# EAGLE design CRD (EAGLE 9.5.2)
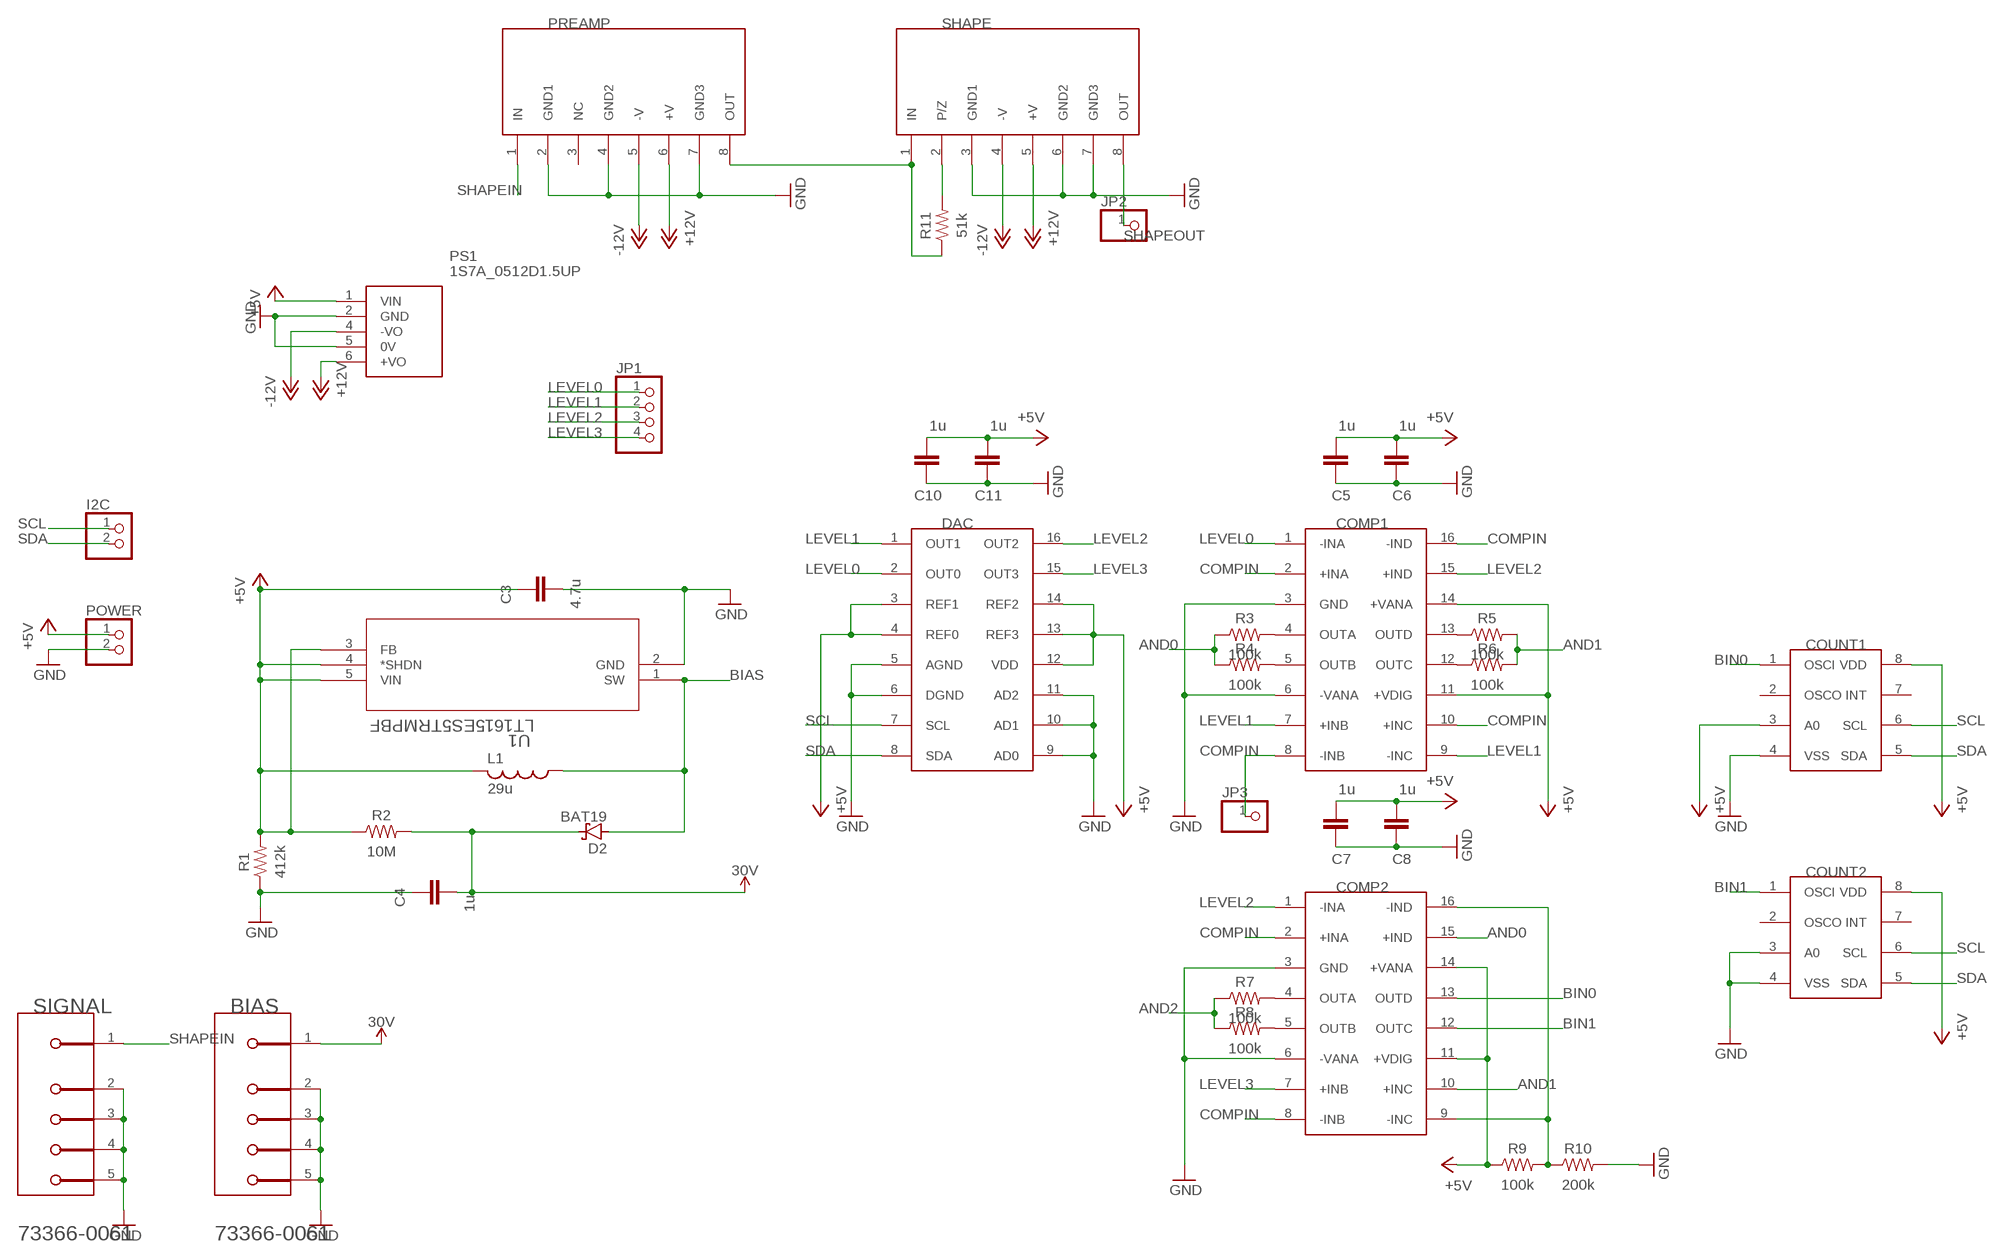
[diagram p0: schematic, sheet 1]

## Parts
BIAS  MOLEX_73366-0061MOLEX_73366-0061_0_0  [MOLEX_73366-0061_0]
C3  4.7u  GRM31CR60J107ME39L  [CAP_1206]
C4  1u  GRM31CR60J107ME39L  [CAP_1206]
C5  1u  GRM31CR60J107ME39L  [CAP_1206]
C6  1u  GRM31CR60J107ME39L  [CAP_1206]
C7  1u  GRM31CR60J107ME39L  [CAP_1206]
C8  1u  GRM31CR60J107ME39L  [CAP_1206]
C10  1u  GRM31CR60J107ME39L  [CAP_1206]
C11  1u  GRM31CR60J107ME39L  [CAP_1206]
COMP1  AD8564ARZ  [SOIC127P1032X265-16N]
COMP2  AD8564ARZ  [SOIC127P1032X265-16N]
COUNT1  PCF8583  [SOIC127P1032X265-8N]
COUNT2  PCF8583  [SOIC127P1032X265-8N]
D2  BAT19  [DO35-10]
DAC  MAX520BEWE+  [SOIC127P1032X265-16N]
I2C  PINHD-1X2  [1X02]
JP1  PINHD-1X4  [1X04]
JP2  PINHD-1X1  [1X01]
JP3  PINHD-1X1  [1X01]
L1  29u  L-USL1812  [L1812]
POWER  PINHD-1X2  [1X02]
PREAMP  CR-113  [HDRV8W64P254_1X8_1016X508X838B]
PS1  1S7A_0512D1.5UP  [1S7A_0505D15UP]
R1  412k  R-US_AXIAL-11.7MM-PITCH  [RESAD1176W63L850D250B]
R2  10M  R-US_AXIAL-11.7MM-PITCH  [RESAD1176W63L850D250B]
R3  100k  R-US_AXIAL-11.7MM-PITCH  [RESAD1176W63L850D250B]
R4  100k  R-US_AXIAL-11.7MM-PITCH  [RESAD1176W63L850D250B]
R5  100k  R-US_AXIAL-11.7MM-PITCH  [RESAD1176W63L850D250B]
R6  100k  R-US_AXIAL-11.7MM-PITCH  [RESAD1176W63L850D250B]
R7  100k  R-US_AXIAL-11.7MM-PITCH  [RESAD1176W63L850D250B]
R8  100k  R-US_AXIAL-11.7MM-PITCH  [RESAD1176W63L850D250B]
R9  100k  R-US_AXIAL-11.7MM-PITCH  [RESAD1176W63L850D250B]
R10  200k  R-US_AXIAL-11.7MM-PITCH  [RESAD1176W63L850D250B]
R11  51k  R-US_AXIAL-11.7MM-PITCH  [RESAD1176W63L850D250B]
SHAPE  CR-200  [HDRV8W64P254_1X8_1016X508X838B]
SIGNAL  MOLEX_73366-0061MOLEX_73366-0061_0_0  [MOLEX_73366-0061_0]
U1  LT1615ES5TRMPBF  [SOT-5_S]

## Nets
+5V: C3.1 C5.2 C6.2 C7.2 C8.2 C10.2 C11.2 COMP1.11(+VDIG) COMP1.14(+VANA) COMP2.11(+VDIG) COMP2.14(+VANA) COUNT1.3(A0) COUNT1.8(VDD) COUNT2.8(VDD) DAC.3(REF1) DAC.4(REF0) DAC.12(VDD) DAC.13(REF3) DAC.14(REF2) L1.2 POWER.1 PS1.1(VIN) R1.2 R2.1 R9.1 U1.3(FB) U1.4(*SHDN) U1.5(VIN)
+12V: PREAMP.6(+V) PS1.6(+VO) SHAPE.5(+V)
-12V: PREAMP.5(-V) PS1.4(-VO) SHAPE.4(-V)
AND0: COMP2.15(+IND) R3.1 R4.1
AND1: COMP2.10(+INC) R5.2 R6.2
AND2: R7.1 R8.1
BIAS: D2.A L1.1 U1.1(SW)
BIN0: COMP2.13(OUTD) COUNT1.1(OSCI)
BIN1: COMP2.12(OUTC) COUNT2.1(OSCI)
COMPIN: COMP1.2(+INA) COMP1.8(-INB) COMP1.10(+INC) COMP1.16(-IND) COMP2.2(+INA) COMP2.8(-INB) JP3.1
GND: BIAS.2(MNT_1) BIAS.3(MNT_2) BIAS.4(MNT_3) BIAS.5(MNT_4) C3.2 C4.1 C5.1 C6.1 C7.1 C8.1 C10.1 C11.1 COMP1.3(GND) COMP1.6(-VANA) COMP2.3(GND) COMP2.6(-VANA) COUNT1.4(VSS) COUNT2.3(A0) COUNT2.4(VSS) DAC.5(AGND) DAC.6(DGND) DAC.9(AD0) DAC.10(AD1) DAC.11(AD2) POWER.2 PREAMP.2(GND1) PREAMP.4(GND2) PREAMP.7(GND3) PS1.2(GND) PS1.5(0V) R1.1 R10.2 SHAPE.3(GND1) SHAPE.6(GND2) SHAPE.7(GND3) SIGNAL.2(MNT_1) SIGNAL.3(MNT_2) SIGNAL.4(MNT_3) SIGNAL.5(MNT_4) U1.2(GND)
LEVEL0: COMP1.1(-INA) DAC.2(OUT0) JP1.1
LEVEL1: COMP1.7(+INB) COMP1.9(-INC) DAC.1(OUT1) JP1.2
LEVEL2: COMP1.15(+IND) COMP2.1(-INA) DAC.16(OUT2) JP1.3
LEVEL3: COMP2.7(+INB) DAC.15(OUT3) JP1.4
N$3: COMP1.4(OUTA) R3.2
N$4: COMP1.5(OUTB) R4.2
N$5: COMP1.13(OUTD) R5.1
N$6: COMP1.12(OUTC) R6.1
N$7: COMP2.4(OUTA) R7.2
N$8: COMP2.5(OUTB) R8.2
N$9: PREAMP.8(OUT) R11.1 SHAPE.1(IN)
N$10: R11.2 SHAPE.2(P/Z)
N$12: COMP2.9(-INC) COMP2.16(-IND) R9.2 R10.1
SCL: COUNT1.6(SCL) COUNT2.6(SCL) DAC.7(SCL) I2C.1
SDA: COUNT1.5(SDA) COUNT2.5(SDA) DAC.8(SDA) I2C.2
SHAPEIN: PREAMP.1(IN) SIGNAL.1
SHAPEOUT: JP2.1 SHAPE.8(OUT)
VIN: BIAS.1 C4.2 D2.C R2.2 ; supply symbol labelled 30V
Unconnected: COUNT1.2(OSCO) COUNT1.7(INT) COUNT2.2(OSCO) COUNT2.7(INT) PREAMP.3(NC)

## Library data of the parts
BIAS SIGNAL = Molex - 73366-0061:MOLEX_73366-0061: MCX Connector Jack, Female Socket 50Ohm Through Hole Solder; AUTOMOTIVE: No; CENTROID_NOT_SPECIFIED: No; CONN_ORIENTATION: Straight; CONTACT_MATERIAL: Gold,Nickel; DATASHEET: https://www.molex.com/webdocs/datasheets/pdf/en-us/0733660061_RF_COAX_CONNECTORS.pdf; DEVICE_CLASS_L1: Connectors; DEVICE_CLASS_L2: RF / Coaxial Connectors; DEVICE_CLASS_L3: unset; DIELECTRIC_MATERIAL: PTFE; DIGIKEY_DESCRIPTION: CONN MCX JACK STR 50 OHM PCB; DIGIKEY_PART_NUMBER: WM5541-ND; FOOTPRINT_URL: https://www.molex.com/pdm_docs/sd/733660061_sd.pdf; FOOTPRINT_VARIANT_NAME_0: Recommended_Land_Pattern; FREQUENCY: 6GHz; HEIGHT: 5.23mm; IMPEDANCE: 50Ω; IS_FEMALE: yes; LEAD_FREE: Yes; MF: Molex; MFG_PACKAGE_IDENT: 0; MFG_PACKAGE_IDENT_DATE: 0; MFG_PACKAGE_IDENT_REV: 0; MOUSER_DESCRIPTION: RF Connectors / Coaxial Connectors MCX PCB JACK; MOUSER_PART_NUMBER: 538-73366-0061; MPN: 73366-0061; NUMBER_OF_CONTACTS: 1; PACKAGE: CONN_JACK; PREFIX: J; ROHS: Yes; SHIELDING: true; STANDOFF_HEIGHT: 0.05mm; TEMPERATURE_RANGE_HIGH: +155°C; TEMPERATURE_RANGE_LOW: -55°C; VERIFICATION_VERSION: 0.0.0.3; VOLTAGE_RATING: 335V
C3-C8 C10 C11 = Resistor_Capacitor:GRM31CR60J107ME39L: CAP CER 100UF 6.3V X5R 1206 Manufacturer's datasheet <https://www.murata.com/~/media/webrenewal/support/library/catalog/products/capacitor/mlcc/c02e.ashx?la=en-us>; CREATED_BY: PCBLayout.com; DIGIKEY_PART_NUMBER: GRM31CR60J107ME39L; MANUFACTURER: Murata Electronics North America; MPN: GRM31CR60J107ME39L; PACKAGE: SMD 1206
COMP1 COMP2 = CRD:AD8564ARZ
COUNT1 COUNT2 = CRD:PCF8583
D2 = diode:BAT19: DIODE barrier diode
DAC = CRD:MAX520BEWE+
I2C POWER = pinhead:PINHD-1X2: PIN HEADER
JP1 = pinhead:PINHD-1X4: PIN HEADER
JP2 JP3 = pinhead:PINHD-1X1: PIN HEADER
L1 = rcl:L-US: INDUCTOR, American symbol; SPICEPREFIX: L
PREAMP = CRD:CR-113
PS1 = 1S7A_0512D1.5UP:1S7A_0512D1.5UP: 1W ? Dual Output DC-DC Converter - Fixed Input - Isolated & Unregulated Source: Datasheet <https://gaptec-electronic.com/datenblaetter/1S7A_1.5UP.pdf>; DESCRIPTION: 1W ? Dual Output DC-DC Converter - Fixed Input - Isolated & Unregulated; HEIGHT: 10.41mm; MANUFACTURER_NAME: Gaptec; MANUFACTURER_PART_NUMBER: 1S7A_0512D1.5UP
R1-R11 = Resistor:R-US: Resistor Fixed - ANSI; CATEGORY: Resistor; SUB-CATEGORY: Fixed
SHAPE = CRD:CR-200
U1 = LT1615ES5TRMPBF:LT1615ES5TRMPBF; DESCRIPTION: Conv DC-DC 1.2V to 15V Step Up Single-Out 1.23V to 36V 0.4A Micropower 5-Pin TSOT-23 T/R; DIGI-KEY_PART_NUMBER: LT1615ES5#TRMPBFCT-ND; MF: Analog Devices; MP: LT1615ES5#TRMPBF; PACKAGE: SOT-5 Analog Devices; PURCHASE-URL: https://pricing.snapeda.com/search/part/LT1615ES5#TRMPBF/?ref=eda

## Board
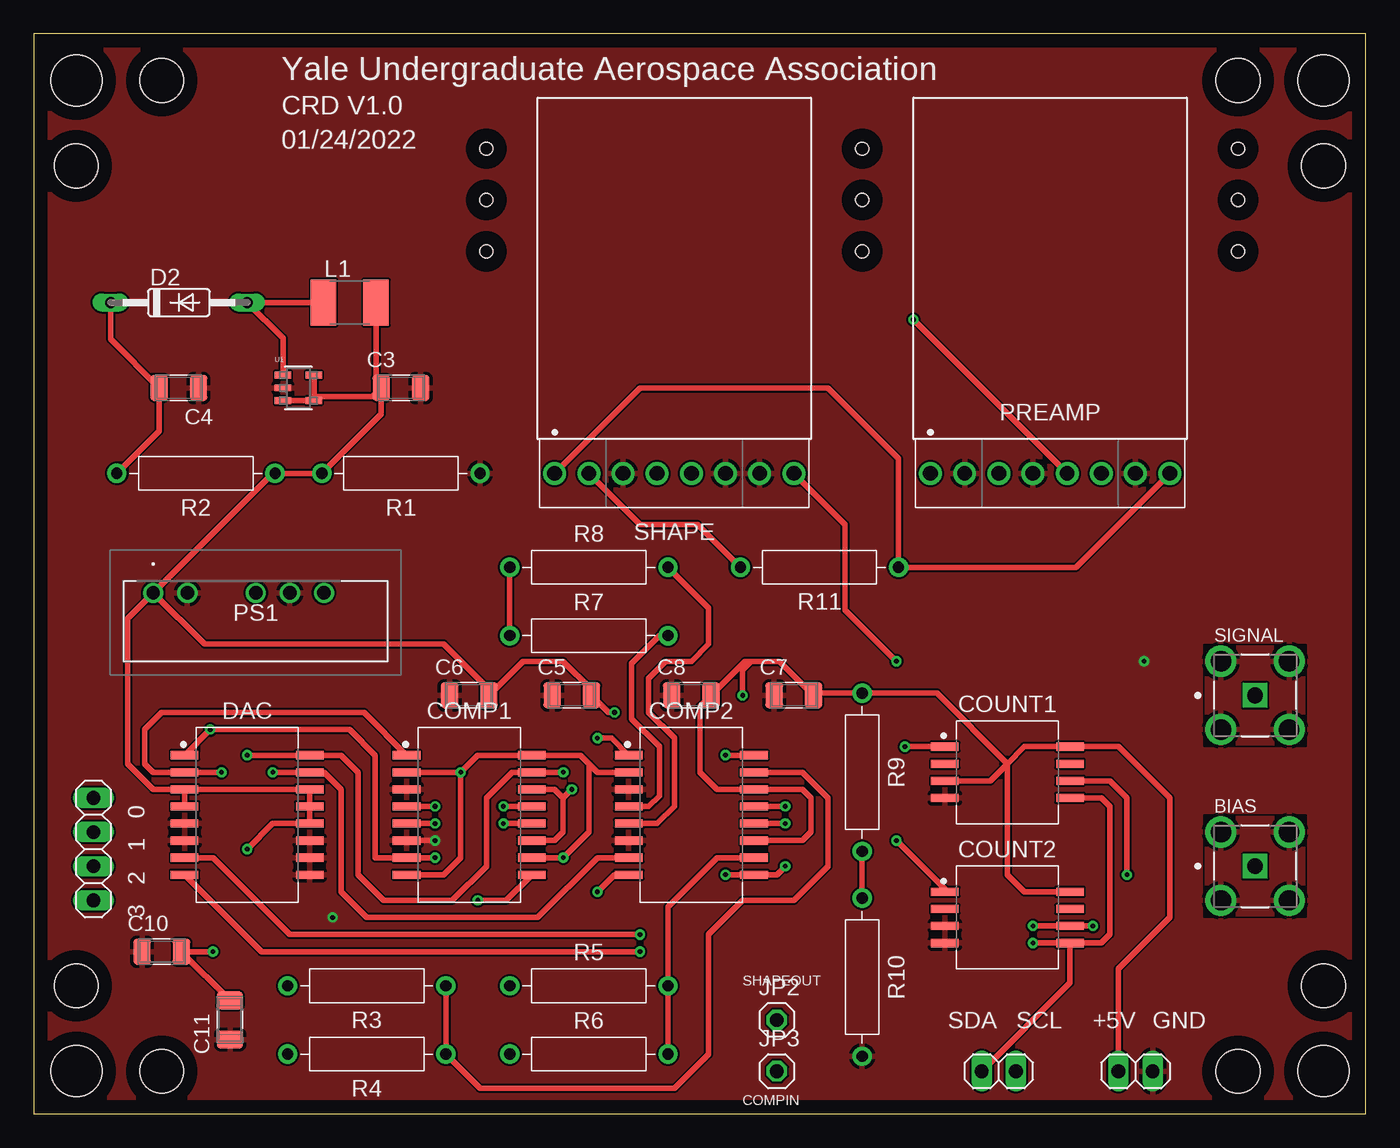
[diagram p1: board, top side]
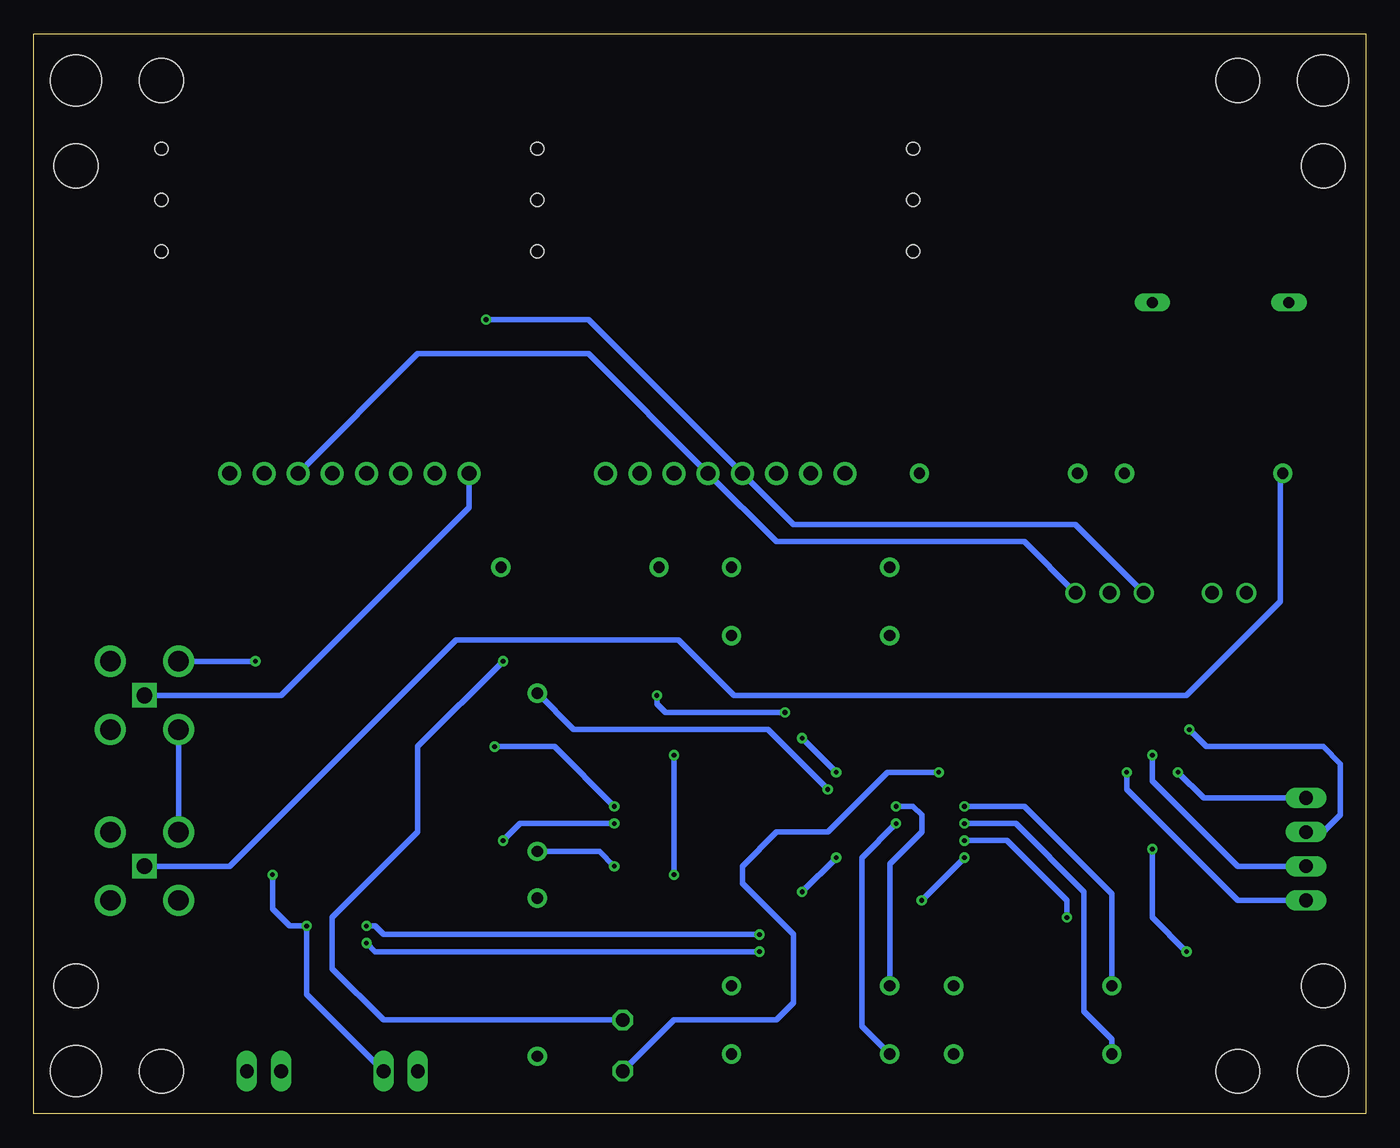
[diagram p2: board, bottom side, seen from below]

Size 99.04 x 80.31 mm. Coordinates in mm from the lower left corner, seen from the top.
Outline: 0,0 99.04,0 99.04,80.31 0,80.31 0,0
Copper layers (1*16): Top 0.035mm / dielectric 1.5mm / Bottom 0.035mm
Design rules "default": minimum track width 6mil, minimum drill 0.35mm, track to track 6mil, track to pad 6mil, pad to pad 6mil, via to via 6mil, smd to smd 6mil, copper to edge 40mil, drill to drill 6mil, minimum pad ring 10mil, minimum via ring 8mil, stop-mask expansion 4mil, vias tented up to drill 0mil, thermal gap 10mil
Holes 0.97 mm at 33.66,67.95 33.66,71.75 61.59,71.75 61.59,67.95 89.53,64.14 89.53,71.75 89.53,67.95 33.66,64.14 61.59,64.14
Holes 3.8 mm at 3.18,76.84 95.89,76.84 3.18,3.18 95.89,3.18
Holes 3.26 mm at 3.18,70.48 9.53,76.84 3.18,9.53 9.53,3.18 95.89,9.53 89.53,3.18 89.53,76.84 95.89,70.48

### Footprints (pad centres in the part's own frame; a part is rotated, then mirrored left to right if it is on the bottom)
MOLEX_73366-0061_0 = drill 1.17 pad 1.82 square: 1 0,0 | drill 1.52 pad 2.32: 2 -2.54,2.54; 3 2.54,2.54; 4 -2.54,-2.54; 5 2.54,-2.54
CAP_1206 = smd 1.29 x 1.91: 1 -1.46,0; 2 1.46,0
SOIC127P1032X265-16N = smd 2.052 x 0.602: 1 -4.654,4.445; 2 -4.654,3.175; 3 -4.654,1.905; 4 -4.654,0.635; 5 -4.654,-0.635; 6 -4.654,-1.905; 7 -4.654,-3.175; 8 -4.654,-4.445; 9 4.654,-4.445; 10 4.654,-3.175; 11 4.654,-1.905; 12 4.654,-0.635; 13 4.654,0.635; 14 4.654,1.905; 15 4.654,3.175; 16 4.654,4.445
SOIC127P1032X265-8N = smd 2.052 x 0.602: 1 -4.654,1.905; 2 -4.654,0.635; 3 -4.654,-0.635; 4 -4.654,-1.905; 5 4.654,-1.905; 6 4.654,-0.635; 7 4.654,0.635; 8 4.654,1.905
DO35-10 = drill 0.813 long: A 5.08,0; C -5.08,0
1X02 = drill 1.016 long: 1 -1.27,0; 2 1.27,0
1X04 = drill 1.016 long: 1 -3.81,0; 2 -1.27,0; 3 1.27,0; 4 3.81,0
1X01 = drill 1.016 octagon: 1 0,0
L1812 = smd 1.9 x 3.4: 1 -1.95,0; 2 1.95,0
HDRV8W64P254_1X8_1016X508X838B = drill 1.105 pad 1.705: 1 0,0; 2 2.54,0; 3 5.08,0; 4 7.62,0; 5 10.16,0; 6 12.7,0; 7 15.24,0; 8 17.78,0
1S7A_0505D15UP = drill 1 pad 1.5: 1 0,0; 2 2.54,0; 4 7.62,0; 5 10.16,0; 6 12.7,0
RESAD1176W63L850D250B = drill 0.83 pad 1.43: 1 -5.88,0; 2 5.88,0
SOT-5_S = smd 1.211 x 0.501: 1 -1.15,0.95; 2 -1.15,0; 3 -1.15,-0.95; 4 1.15,-0.95; 5 1.15,0.95

### Placement (x,y rotation side)
BIAS  90.8,18.41 0 top
C3  27.3,53.98 0 top
C4  10.79,53.98 180 top
C5  40,31.12 0 top
C6  32.38,31.12 0 top
C7  56.52,31.12 0 top
C8  48.89,31.12 0 top
C10  9.53,12.06 0 top
C11  14.6,6.99 90 top
COMP1  32.38,22.23 0 top
COMP2  48.89,22.23 0 top
COUNT1  72.39,25.4 0 top
COUNT2  72.39,14.61 0 top
D2  10.79,60.33 0 top
DAC  15.88,22.23 0 top
I2C  71.75,3.18 180 top
JP1  4.45,19.69 270 top
JP2  55.25,6.99 0 top
JP3  55.25,3.18 0 top
L1  23.49,60.33 0 top
POWER  81.91,3.18 0 top
PREAMP  66.67,47.62 0 top
PS1  8.89,38.73 0 top
R1  27.3,47.62 180 top
R2  12.06,47.62 180 top
R3  24.77,9.53 180 top
R4  24.77,4.45 180 top
R5  41.27,9.53 0 top
R6  41.27,4.45 0 top
R7  41.27,35.56 0 top
R8  41.27,40.64 0 top
R9  61.59,25.4 270 top
R10  61.59,10.16 270 top
R11  58.42,40.64 180 top
SHAPE  38.73,47.62 0 top
SIGNAL  90.8,31.12 0 top
U1  19.69,53.98 0 top

### Tracks (layer width: path | path; a pad name or v marks a point on that pad's centre or on a via)
+5V  (via drill 0.35)
  Top 0.406: C3.1 25.21,53.34 21.15,53.34 U1.4 | C3.1 25.84,52.05 R1.2 R2.1 17.78,47.62 PS1.1 | DAC.4 DAC.3 | COMP1.14 38.73,24.13 39.37,23.5 | 39.37,23.5 39.37,20.96 38.73,20.32 COMP1.11 | 72.39,26.04 71.12,24.77 COUNT1.3 | 72.39,26.04 73.66,27.3 COUNT1.8 80.64,27.3 84.45,23.5 84.45,14.61 80.64,10.79 POWER.1 | COUNT2.8 73.66,16.51 72.39,17.78 72.39,26.04 | L1.2 25.45,54.38 C3.1 | DAC.3 DAC.14 DAC.13 DAC.12 17.78,21.59 v15.88,19.69 | 53.34,33.66 52.89,33.66 C8.2 49.53,30.29 49.53,25.4 50.8,24.13 COMP2.14 57.15,24.13 57.78,23.5 57.78,20.96 57.15,20.32 COMP2.11 | 53.34,33.66 55.44,33.66 C7.2 58.14,31.28 R9.1 67.14,31.28 72.39,26.04 | DAC.3 8.89,24.13 6.99,26.04 6.99,36.83 PS1.1 | 39.37,23.5 v40,24.13 | v43.18,29.84 42.73,29.84 C5.2 41.46,31.56 39.37,33.66 36.38,33.66 C6.2 33.84,31.56 30.48,34.93 12.7,34.93 PS1.1 | v52.7,31.12 52.7,33.02 53.34,33.66 | U1.3 U1.4 | U1.4 U1.5 | v13.33,12.06 C10.2 C11.2
  Bottom 0.406: v40,24.13 44.45,28.58 58.89,28.58 R9.1 | v43.18,29.84 52.07,29.84 52.7,30.48 v52.7,31.12 | v13.33,12.06 15.88,14.61 v15.88,19.69
+12V
  Bottom 0.406: PS1.6 25.4,42.55 43.81,42.55 SHAPE.5 57.78,56.52 70.48,56.52 PREAMP.6
-12V  (via drill 0.35)
  Top 0.406: v65.41,59.06 PREAMP.5
  Bottom 0.406: PS1.4 21.59,43.82 42.55,43.82 SHAPE.4 57.78,59.06 v65.41,59.06
AND0
  Top 0.406: R3.1 R4.1 33.18,1.91 47.62,1.91 50.16,4.45 50.16,13.33 52.7,15.88 56.52,15.88 59.05,18.41 59.05,23.5 57.15,25.4 COMP2.15
AND1
  Top 0.406: COMP2.10 50.8,19.05 47.16,15.4 R5.2 R6.2
AND2
  Top 0.406: R8.1 R7.1
BIAS
  Top 0.406: U1.1 18.53,57.67 D2.A L1.1
BIN0  (via drill 0.35)
  Top 0.406: COMP2.13 v55.88,22.86 | v64.77,27.3 COUNT1.1
  Bottom 0.406: v55.88,22.86 60.33,27.3 v64.77,27.3
BIN1  (via drill 0.35)
  Top 0.406: COMP2.12 v55.88,21.59 | v64.14,20.32 67.74,16.72 COUNT2.1
  Bottom 0.406: v55.88,21.59 62.86,21.59 v64.14,20.32
COMPIN  (via drill 0.35)
  Top 0.406: COMP1.2 v31.75,25.4 | v31.75,25.4 33.02,26.67 COMP1.16 40.64,26.67 41.27,26.04 | COMP1.8 30.48,17.78 31.75,19.05 v31.75,25.4 | COMP1.10 v39.37,19.05 41.27,20.96 41.27,26.04 | COMP2.2 41.91,25.4 41.27,26.04 | COMP2.8 43.18,17.78 v41.91,16.51
  Bottom 0.406: v41.91,16.51 v39.37,19.05 | v31.75,25.4 35.56,25.4 40,20.96 43.81,20.96 46.35,18.41 46.35,17.15 42.55,13.33 42.55,8.26 43.81,6.99 51.43,6.99 JP3.1
GND  (via drill 0.35)
  Top 0.406: COMP1.6 v29.84,20.32
  Bottom 0.406: SIGNAL.4 BIAS.2 | v29.84,20.32 26.67,20.32 22.23,15.88 v22.23,14.61 | SIGNAL.2 v82.55,33.66
  pour Top: 0,0 0,80.01 99.06,80.01 99.06,0
LEVEL0  (via drill 0.35)
  Top 0.406: COMP1.1 24.56,29.84 9.53,29.84 8.26,28.58 8.26,26.04 8.89,25.4 DAC.2 v13.97,25.4
  Bottom 0.406: v13.97,25.4 12.06,23.5 JP1.1
LEVEL1  (via drill 0.35)
  Top 0.406: DAC.1 v13.13,28.58 23.49,28.58 25.4,26.67 25.4,19.05 COMP1.7 v29.84,19.05 | COMP1.9 35.13,15.88 v33.02,15.88
  Bottom 0.406: v29.84,19.05 v33.02,15.88 | v13.13,28.58 11.86,27.3 3.18,27.3 1.9,26.04 1.9,22.23 3.18,20.96 JP1.2
LEVEL2  (via drill 0.35)
  Top 0.406: v39.37,25.4 COMP1.15 35.56,25.4 33.66,23.5 33.66,18.41 31.11,15.88 26.03,15.88 24.13,17.78 24.13,25.4 22.86,26.67 DAC.16 v15.88,26.67 | v41.91,27.94 42.97,27.94 COMP2.1
  Bottom 0.406: v39.37,25.4 v41.91,27.94 | v15.88,26.67 15.88,24.77 9.53,18.41 JP1.3
LEVEL3  (via drill 0.35)
  Top 0.406: COMP2.7 41.91,19.05 37.46,14.61 24.77,14.61 22.86,16.51 22.86,24.13 21.59,25.4 DAC.15 v17.78,25.4
  Bottom 0.406: v17.78,25.4 17.78,24.13 9.53,15.88 JP1.4
N$3  (via drill 0.35)
  Top 0.406: COMP1.4 v29.84,22.86
  Bottom 0.406: v29.84,22.86 25.4,22.86 18.88,16.34 R3.2
N$4  (via drill 0.35)
  Top 0.406: COMP1.5 v29.84,21.59
  Bottom 0.406: v29.84,21.59 26.03,21.59 20.95,16.51 20.95,7.62 18.88,5.55 R4.2
N$5  (via drill 0.35)
  Top 0.406: COMP1.13 v34.92,22.86
  Bottom 0.406: v34.92,22.86 33.66,22.86 33.02,22.23 33.02,20.96 35.39,18.58 R5.1
N$6  (via drill 0.35)
  Top 0.406: COMP1.12 v34.92,21.59
  Bottom 0.406: v34.92,21.59 37.46,19.05 37.46,6.51 R6.1
N$7
  Top 0.406: COMP2.4 45.72,22.86 46.52,23.66 46.52,27.3 44.45,29.38 44.45,33.49 46.52,35.56 R7.2
N$8
  Top 0.406: COMP2.5 46.35,21.59 47.62,22.86 47.62,27.94 45.72,29.84 45.72,32.39 46.99,33.66 48.89,33.66 50.16,34.93 50.16,37.63 R8.2
N$9
  Top 0.406: SHAPE.1 45.09,53.98 59.05,53.98 64.3,48.73 R11.1 77.47,40.64 PREAMP.8
N$10
  Top 0.406: SHAPE.2 45.09,43.82 47.62,43.82 48.26,43.82 49.36,43.82 R11.2
N$12  (via drill 0.35)
  Top 0.406: v51.43,17.78 COMP2.9 55.25,17.78 v55.88,18.41 | v51.43,26.67 COMP2.16 | R9.2 R10.1
  Bottom 0.406: v51.43,17.78 v51.43,26.67 | v55.88,18.41 56.98,19.52 R9.2
SCL  (via drill 0.35)
  Top 0.406: COUNT1.6 80.01,24.77 81.28,23.5 v81.28,17.78 | v78.74,13.97 COUNT2.6 v74.3,13.97 | DAC.7 13.33,19.05 19.05,13.33 v45.09,13.33
  Bottom 0.406: v81.28,17.78 81.28,15.24 80.01,13.97 v78.74,13.97 78.74,8.89 I2C.1 | v45.09,13.33 73.02,13.33 73.66,13.97 v74.3,13.97
SDA  (via drill 0.35)
  Top 0.406: COUNT1.5 79.38,23.5 80.01,22.86 80.01,13.33 79.38,12.7 COUNT2.5 | COUNT2.5 77.04,9.73 I2C.2 | DAC.8 16.94,12.06 v45.09,12.06 | v74.3,12.7 COUNT2.5
  Bottom 0.406: v45.09,12.06 73.66,12.06 v74.3,12.7
SHAPEIN
  Bottom 0.406: SIGNAL.1 80.64,31.12 66.67,45.09 PREAMP.1
SHAPEOUT  (via drill 0.35)
  Top 0.406: SHAPE.8 60.33,43.82 60.33,37.47 v64.14,33.66
  Bottom 0.406: v64.14,33.66 70.48,27.3 70.48,20.96 76.83,14.61 76.83,10.79 73.02,6.99 JP2.1
VIN
  Top 0.406: D2.C 5.72,57.59 C4.2 9.33,50.78 R2.2
  Bottom 0.406: R2.2 6.35,47.46 6.35,38.1 13.33,31.12 46.99,31.12 51.12,35.24 67.63,35.24 84.45,18.41 BIAS.1

### Text on the board
tPlace: Yale Undergraduate Aerospace Association | CRD V1.0 | 01/24/2022 | 3 2 1 0 | SHAPEOUT | SDA | SCL | +5V | GND | COMPIN | /Users/zacharyandalman/Downloads/imageonline-monochrome-9350853.bmp | /Users/zacharyandalman/Downloads/imageonline-monochrome-9350853.bmp